# Altium schematic sheet Memory.SchDoc
size A4
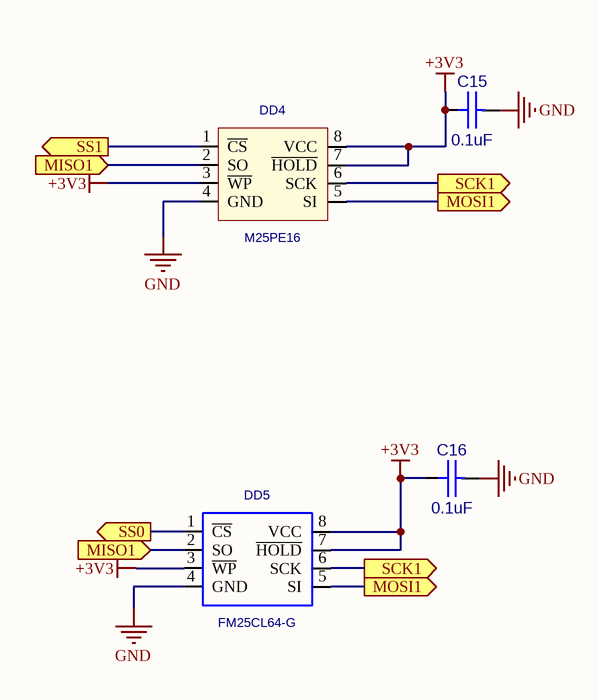
[diagram p0: Memory.SchDoc]

## Parts
C15  0.1uF  [CC0603]
C16  0.1uF  [CC0603]
DD4  M25PE16  [EIAJ_SO8]
DD5  FM25CL64-G  [SO-8]

## Ports
MISO1 (in), MOSI1 (out), SCK1 (out), SS0 (out), SS1 (out)

## Nets
+3V3: C15.1(A) C16.1(A) DD4.3(~{WP}) DD4.7(~{HOLD}) DD4.8(VCC) DD5.3(~{WP}) DD5.7(~{HOLD}) DD5.8(VCC)
GND: C15.2(B) C16.2(B) DD4.4(GND) DD5.4(GND)
MISO1: DD4.2(SO) DD5.2(SO) ; port MISO1
MOSI1: DD4.5(SI) DD5.5(SI) ; port MOSI1
SCK1: DD4.6(SCK) DD5.6(SCK) ; port SCK1
SS0: DD5.1(~{CS}) ; port SS0
SS1: DD4.1(~{CS}) ; port SS1

## Library data of the parts
C15 C16 = CC0603: Value: 0.1uF
DD4 = S25FL016A0LMFI01: Value: M25PE16
DD5 = FM25CL64-G: Value: *